# Altium schematic sheet Zener Diode.schdoc
size 127 x 99 mm
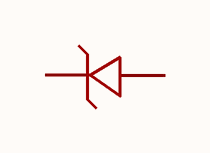
[diagram p0: Zener Diode.schdoc]

## Parts
D?  BZT52B6V8  [SOD-123_L2.8-W1.8-LS3.7-RD]  (value not drawn)

## Nets

Not connected (* = marked no-connect by the designer): D? 1(K) 2(A)

## Library data of the parts
D? = BZT52B6V8_C213147: Manufacturer: FMS(美丽微); Add into BOM: yes; Diode Configuration: Single; Zener Voltage (Nom): 6.8V; Reverse Leakage Current (Ir): 2uA@4V; Zener Voltage (Range): 6.66V~6.94V; Power Dissipation: 350mW; Zener Impedance (Zzt): 15Ω; Symbol: BZT52B6V8; Device: BZT52B6V8_C213147; LCSC Part Name: BZT52B6V8; Supplier Part: C213147; Manufacturer Part: BZT52B6V8; Supplier Footprint: SOD-123; JLCPCB Part Class: Extended Part; Datasheet: https://atta.szlcsc.com/upload/public/pdf/source/20180504/C213215_D8AFED6AF7B069D42DB4E73D6157B86A.pdf; Supplier: LCSC; Convert to PCB: yes